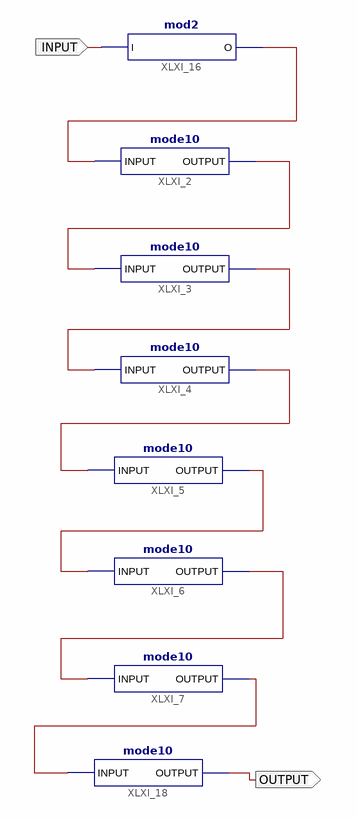
[diagram p0: schematic sheet 1]
// Xilinx ISE schematic Div2M.sch (spartan6) as structural Verilog: 8 symbols, 2 ports
module Div2M (
  input  INPUT,
  output OUTPUT
);

  wire XLXN_1, XLXN_2, XLXN_3, XLXN_4, XLXN_7, XLXN_8, XLXN_9;

  mode10 XLXI_2 (.INPUT(XLXN_1), .OUTPUT(XLXN_2));
  mode10 XLXI_3 (.INPUT(XLXN_2), .OUTPUT(XLXN_3));
  mode10 XLXI_4 (.INPUT(XLXN_3), .OUTPUT(XLXN_4));
  mode10 XLXI_5 (.INPUT(XLXN_4), .OUTPUT(XLXN_7));
  mode10 XLXI_6 (.INPUT(XLXN_7), .OUTPUT(XLXN_8));
  mode10 XLXI_7 (.INPUT(XLXN_8), .OUTPUT(XLXN_9));
  mod2 XLXI_16 (.I(INPUT), .O(XLXN_1));
  mode10 XLXI_18 (.INPUT(XLXN_9), .OUTPUT(OUTPUT));
endmodule
